# Altium schematic sheet CPU.SchDoc
size A4
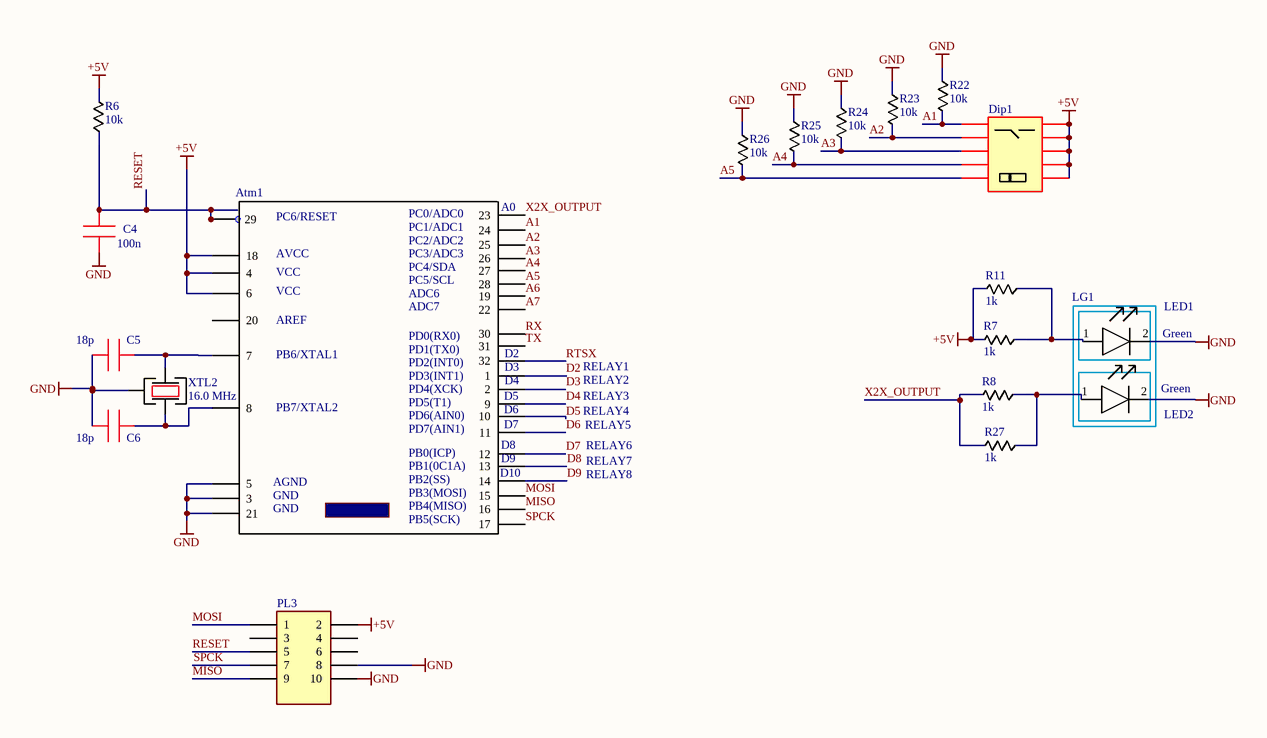
[diagram p0: CPU.SchDoc]

## Parts
Atm1  (no value)  [Atmega168]
C4  100n  [0603_Cap]
C5  18p  [0603_Cap]
C6  18p  [0603_Cap]
Dip1  (no value)  [DipSwitch 5]
LED1  (no value)  [0603 - LED]
LED2  (no value)  [0603 - LED]
LG1  (no value)  [LED SMD DayLight]
PL3  (no value)  [IDC-10MS]
R6  10k  [0603_Res]
R7  1k  [0603_Res]
R8  1k  [0603_Res]
R11  1k  [0603_Res]
R22  10k  [0603_Res]
R23  10k  [0603_Res]
R24  10k  [0603_Res]
R25  10k  [0603_Res]
R26  10k  [0603_Res]
R27  1k  [0603_Res]
XTL2  16.0 MHz  [KX-7 XTAL]

## Nets
+5V: Atm1.4 Atm1.6 Atm1.18 Dip1.1 Dip1.2 Dip1.3 Dip1.4 Dip1.5 PL3.2 R6.2 R7.2 R11.2
GND: Atm1.3 Atm1.5 Atm1.21 C4.1 C5.1 C6.1 LED1.2 LED2.2 PL3.8 PL3.10 R22.1 R23.1 R24.1 R25.1 R26.1 XTL2.2
A1: Atm1.24 Dip1.12 R22.2
A2: Atm1.25 Dip1.13 R23.2
A3: Atm1.26 Dip1.14 R24.2
A4: Atm1.27 Dip1.15 R25.2
A5: Atm1.28 Dip1.16 R26.2
A6: Atm1.19
A7: Atm1.22
D2: Atm1.1
D3: Atm1.2
D4: Atm1.9
D5: Atm1.10
D6: Atm1.11
D7: Atm1.12
D8: Atm1.13
D9: Atm1.14
MISO: Atm1.16 PL3.9
MOSI: Atm1.15 PL3.1
RESET: Atm1.29 C4.2 PL3.5 R6.1
RTSX: Atm1.32
RX: Atm1.30
SPCK: Atm1.17 PL3.7
TX: Atm1.31
X2X_OUTPUT: Atm1.23 R8.2 R27.2
NetAtm1_7: Atm1.7 C5.2 XTL2.1
NetAtm1_8: Atm1.8 C6.2 XTL2.3
NetLED1_1: LED1.1 R7.1 R11.1
NetLED2_1: LED2.1 R8.1 R27.1

Not connected (* = marked no-connect by the designer): Atm1 20; PL3 3 4 6

## Notes on the sheet
- (near Atm1) A0
- (near Atm1) D3
- (near Atm1) D2
- RELAY1
- (near LED1) Green
- (near Atm1) D5
- (near Atm1) D6
- (near Atm1) D7
- (near Atm1) D4
- RELAY2
- RELAY3
- RELAY4
- RELAY5
- Green
- (near Atm1) D10
- (near Atm1) D8
- (near Atm1) D9
- RELAY7
- RELAY8
- RELAY6
- (in symbol Atmega328) PC0/ADC0; PC6/RESET; PC1/ADC1; PC2/ADC2; AVCC; PC3/ADC3; PC4/SDA; VCC; PC5/SCL; ADC6; ADC7; AREF; PD0(RX0); PB6/XTAL1; PD1(TX0); PD2(INT0); PD3(INT1); PD4(XCK); PD5(T1); PB7/XTAL2; PD6(AIN0); PD7(AIN1); PB0(ICP); PB1(0C1A); AGND; PB2(SS); GND; ATMega328; PB3(MOSI); PB4(MISO); PB5(SCK)

## Library data of the parts
Atm1 = Atmega328: Part Description: 8-bit MCU 32KB 20MHz 1.8V-5.5V; Part Number: Atmega328P-AU
C4 = Capasitor 0805: Part Description: Multilayer Ceramic Capacitor 50 V 0.1uF Y5V 0603 -20/+80%; Part Number: CC0603ZRY5V9BB104
C5 C6 = Capasitor 0805: Part Description: Multilayer Ceramic Capacitor 50 V 18 pF C0G 0603 5%; Part Number: CC0603JRNPO9BN180
Dip1 = DipSwitch5: Part Description: Bit switch 5 bits; Part Number: DPL-05-V
LED1 LED2 = LED 0603: Part Number: KP-1608SGC; Part Description: 0603 Single Colour LED Green
LG1 = Light Guide 2: Part Number: 5151094F; Part Description: Light Guide
PL3 = IDC-10MS: Part Description: Socket; IDC; male; PIN: 10; straight;; Part Number: DS1013-10SSIB1-B-0
R6 R22-R26 = Resistor 0805: Part Description: Thin Film Resistors - SMD 10K ohm 1% 1/10W; Part Number: RT0603FRE0710KL
R7 R8 R11 R27 = Resistor 0805: Part Description: Thick Film Resistor - 0603, 1kOhms, 1%, 1/10W; Part Number: RC0603FR-071KL
XTL2 = KX-7: Part Description: CRYSTAL 16.0000MHZ 18PF; Part Number: Geyer KX-7 16.0 MHz